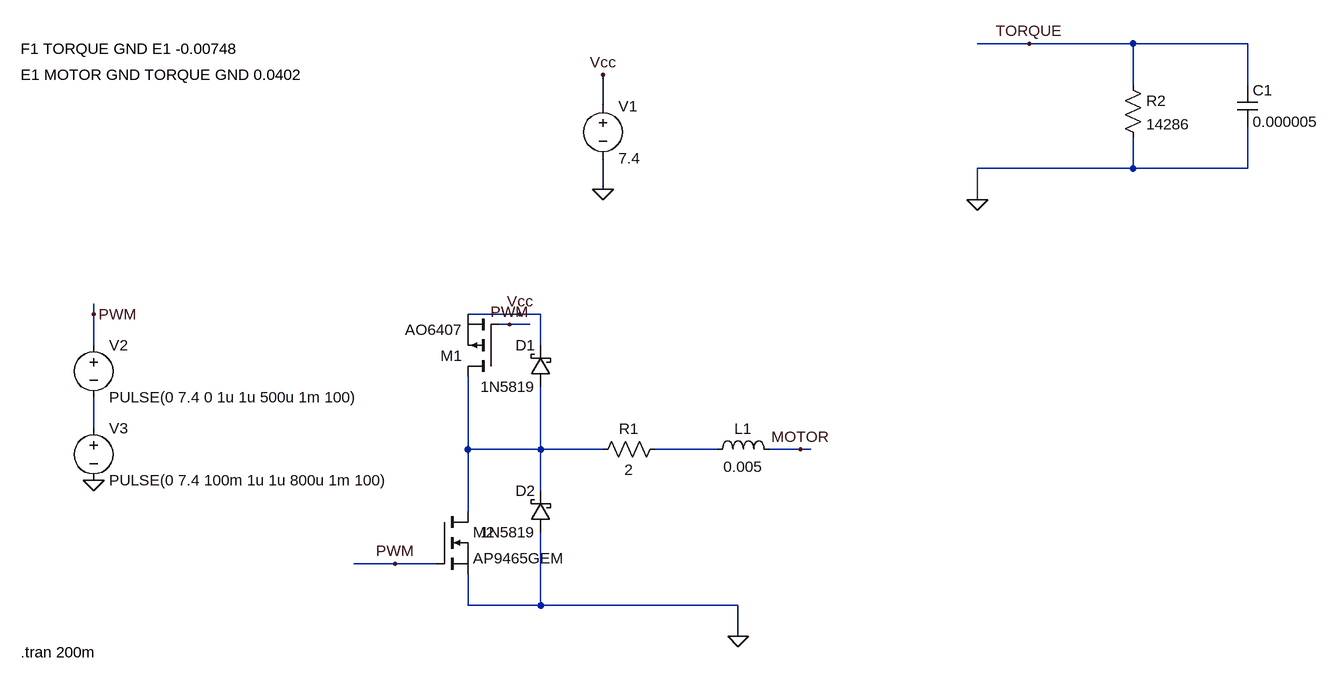
[diagram p0: schematic pwm-half-bridge-motor-driver.asc]
pwm-half-bridge-motor-driver.asc, the LTspice schematic file:
Version 4
SHEET 1 1720 680
WIRE 736 -432 656 -432
WIRE 896 -432 736 -432
WIRE 1072 -432 896 -432
WIRE 896 -368 896 -432
WIRE 1072 -368 1072 -432
WIRE 80 -336 80 -384
WIRE 896 -240 896 -288
WIRE 896 -240 656 -240
WIRE 1072 -240 1072 -304
WIRE 1072 -240 896 -240
WIRE 80 -208 80 -256
WIRE 656 -192 656 -240
WIRE -704 -16 -704 -32
WIRE -48 -16 -128 -16
WIRE -16 -16 -48 -16
WIRE -64 0 -80 0
WIRE -32 0 -64 0
WIRE -704 32 -704 -16
WIRE -16 32 -16 -16
WIRE -704 160 -704 112
WIRE -128 192 -128 80
WIRE -16 192 -16 96
WIRE -16 192 -128 192
WIRE 80 192 -16 192
WIRE 256 192 160 192
WIRE 384 192 336 192
WIRE 400 192 384 192
WIRE -16 256 -16 192
WIRE -128 288 -128 192
WIRE -240 368 -304 368
WIRE -176 368 -240 368
WIRE -128 432 -128 384
WIRE -16 432 -16 320
WIRE -16 432 -128 432
WIRE 288 432 -16 432
WIRE 288 480 288 432
FLAG 288 480 0
FLAG 80 -384 Vcc
FLAG 80 -208 0
FLAG -48 -16 Vcc
FLAG 656 -192 0
FLAG -704 -16 PWM
FLAG 736 -432 TORQUE
FLAG -64 0 PWM
FLAG -240 368 PWM
FLAG 384 192 MOTOR
FLAG -704 240 0
SYMBOL res 176 176 R90
WINDOW 0 0 56 VBottom 2
WINDOW 3 32 56 VTop 2
SYMATTR InstName R1
SYMATTR Value 2
SYMBOL ind 240 208 R270
WINDOW 0 32 56 VTop 2
WINDOW 3 5 56 VBottom 2
SYMATTR InstName L1
SYMATTR Value 0.005
SYMBOL schottky 0 96 R180
WINDOW 0 24 64 Left 2
WINDOW 3 24 0 Left 2
SYMATTR InstName D1
SYMATTR Value 1N5819
SYMBOL schottky 0 320 R180
WINDOW 0 24 64 Left 2
WINDOW 3 24 0 Left 2
SYMATTR InstName D2
SYMATTR Value 1N5819
SYMBOL cap 1056 -368 R0
SYMATTR InstName C1
SYMATTR Value 0.000005
SYMBOL res 880 -384 R0
SYMATTR InstName R2
SYMATTR Value 14286
SYMBOL voltage 80 -352 R0
WINDOW 123 0 0 Left 2
WINDOW 39 0 0 Left 2
SYMATTR InstName V1
SYMATTR Value 7.4
SYMBOL voltage -704 16 R0
WINDOW 123 0 0 Left 2
WINDOW 39 0 0 Left 2
SYMATTR InstName V2
SYMATTR Value PULSE(0 7.4 0 1u 1u 500u 1m 100)
SYMBOL nmos -176 288 R0
SYMATTR InstName M2
SYMATTR Value AP9465GEM
SYMBOL pmos -80 80 R180
SYMATTR InstName M1
SYMATTR Value AO6407
SYMBOL voltage -704 144 R0
WINDOW 123 0 0 Left 2
WINDOW 39 0 0 Left 2
SYMATTR InstName V3
SYMATTR Value PULSE(0 7.4 100m 1u 1u 800u 1m 100)
TEXT -816 -424 Left 2 !F1 TORQUE GND E1 -0.00748
TEXT -816 -384 Left 2 !E1 MOTOR GND TORQUE GND 0.0402
TEXT -816 504 Left 2 !.tran 200m

The netlist it stands for:
* pwm-half-bridge-motor-driver.asc
R1 N003 N002 2
L1 N003 MOTOR 0.005
D1 N002 Vcc 1N5819
D2 0 N002 1N5819
C1 TORQUE 0 0.000005
R2 TORQUE 0 14286
V1 Vcc 0 7.4
V2 PWM N001 PULSE(0 7.4 0 1u 1u 500u 1m 100)
M2 N002 PWM 0 0 AP9465GEM
M1 N002 PWM Vcc Vcc AO6407
V3 N001 0 PULSE(0 7.4 100m 1u 1u 800u 1m 100)
.model D D
.lib standard.dio
.model NMOS NMOS
.model PMOS PMOS
.lib standard.mos
F1 TORQUE GND E1 -0.00748
E1 MOTOR GND TORQUE GND 0.0402
.tran 200m
.backanno
.end